# Altium project projet3.PrjPcb
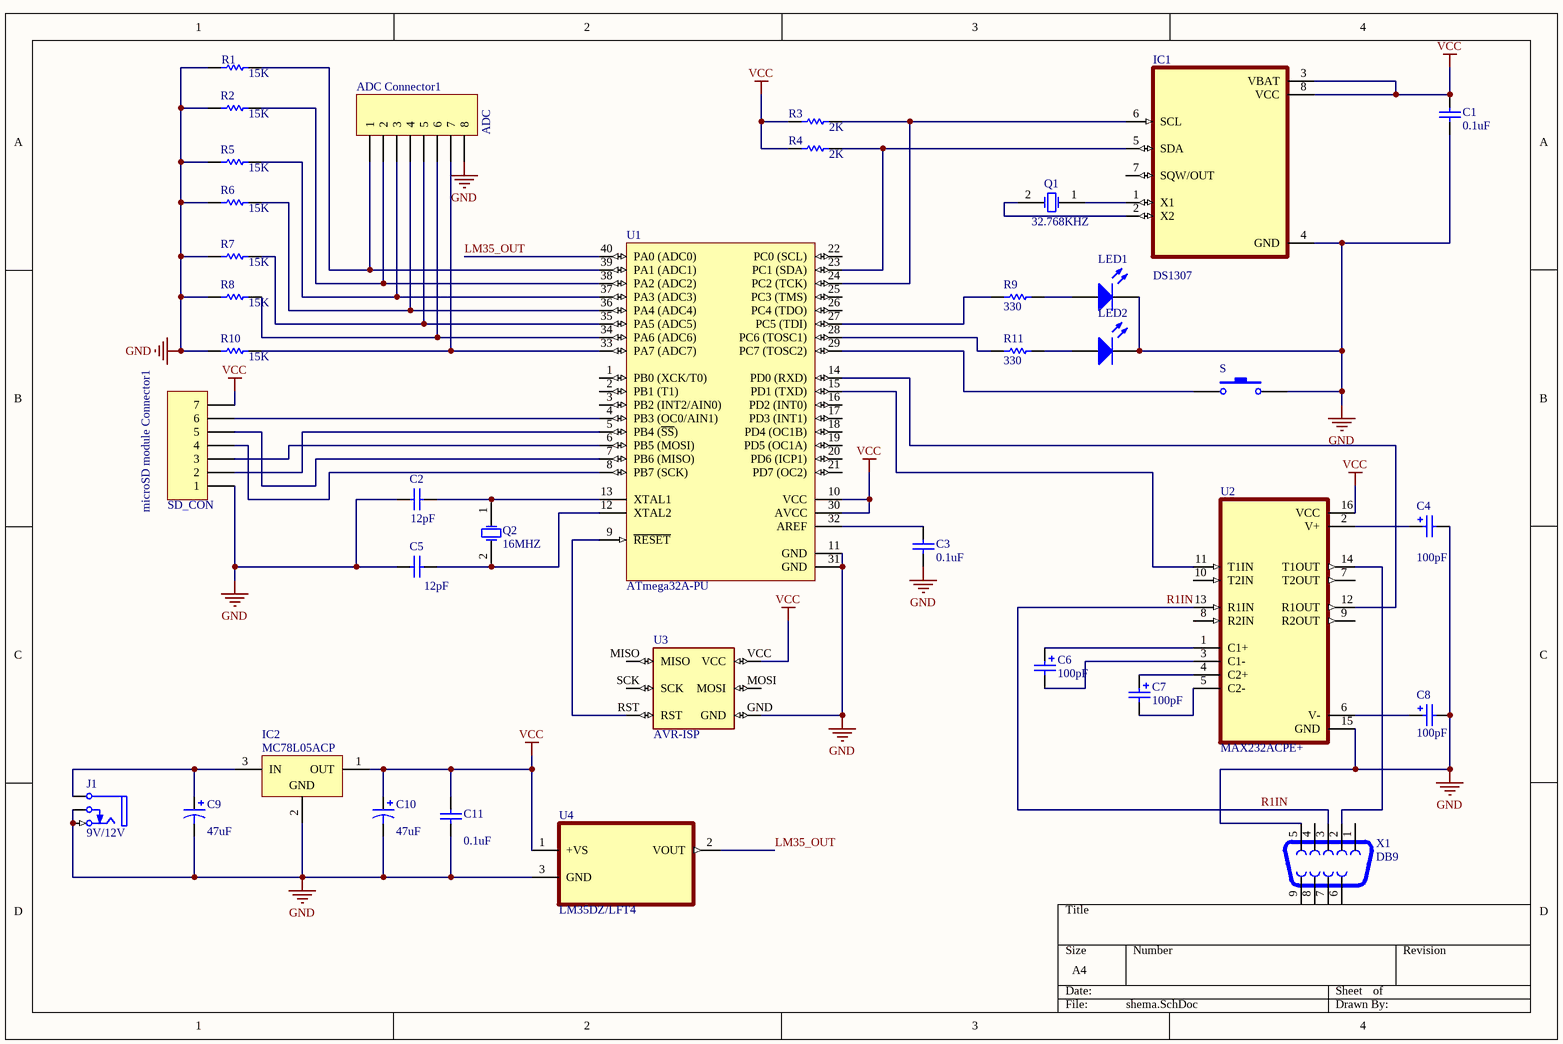
[diagram p0: shema.SchDoc]
1 sheet, 37 parts. Net scope: global (net labels, ports and power ports of the same name join across sheets).

## Sheet shema.SchDoc
size A4

### Parts
ADC_Connector1  ADC  [HDR1X8]
C1  value 0.1uF  [RAD-0.3]  (hidden comment: Cap)
C2  value 12pF  [RAD-0.3]  (hidden comment: Cap)
C3  value 0.1uF  [RAD-0.3]  (hidden comment: Cap)
C4  value 100pF  [POLAR0.8]  (hidden comment: Cap Pol2)
C5  value 12pF  [RAD-0.3]  (hidden comment: Cap)
C6  value 100pF  [POLAR0.8]  (hidden comment: Cap Pol2)
C7  value 100pF  [POLAR0.8]  (hidden comment: Cap Pol2)
C8  value 100pF  [POLAR0.8]  (hidden comment: Cap Pol2)
C9  value 47uF  [RB7.6-15]  (hidden comment: Cap Pol1)
C10  value 47uF  [RB7.6-15]  (hidden comment: Cap Pol1)
C11  value 0.1uF  [RAD-0.3]  (hidden comment: Cap)
IC1  DS1307  [DIP794W47P254L991H457Q8]
IC2  MC78L05ACP  [29-04]
J1  9V/12V  [JACK/6-V3A]
LED1  LED0  [LED-0]  (value not drawn)
LED2  LED0  [LED-0]  (value not drawn)
microSD_module_Connector1  SD_CON  [HDR1X7]
Q1  FREQ: 32.768KHZ  [R38]  (hidden comment: XTAL)
Q2  FREQ: 16MHZ  [R38]  (hidden comment: XTAL)
R1  value 15K  [AXIAL-0.3]  (hidden comment: Res1)
R2  value 15K  [AXIAL-0.3]  (hidden comment: Res1)
R3  value 2K  [AXIAL-0.3]  (hidden comment: Res1)
R4  value 2K  [AXIAL-0.3]  (hidden comment: Res1)
R5  value 15K  [AXIAL-0.3]  (hidden comment: Res1)
R6  value 15K  [AXIAL-0.3]  (hidden comment: Res1)
R7  value 15K  [AXIAL-0.3]  (hidden comment: Res1)
R8  value 15K  [AXIAL-0.3]  (hidden comment: Res1)
R9  value 330  [AXIAL-0.3]  (hidden comment: Res1)
R10  value 15K  [AXIAL-0.3]  (hidden comment: Res1)
R11  value 330  [AXIAL-0.3]  (hidden comment: Res1)
S  SW-PB  [SPST-2]  (value not drawn)
U1  ATmega32A-PU  [40P6]
U2  MAX232ACPE+  [DIP794W47P254L1943H457Q16]
U3  AVR-ISP  [AVR-ISP]
U4  LM35DZ/LFT4  [TO127P254X495-3P]
X1  DB9  [DB9]

### Nets
GND: ADC_Connector1.8 C1.1 C2.1 C3.2 C4.2 C5.1 C8.2 C9.2 C10.2 C11.1 IC1.4(GND) IC2.2(GND) J1.1(T) J1.2(TN) LED1.2(K) LED2.2(K) microSD_module_Connector1.1 R1.1 R2.1 R5.1 R6.1 R7.1 R8.1 R10.1 S.2 U1.11(GND) U1.31(GND) U2.15(GND) U3.GND U4.3(GND) X1.5
VCC: C1.2 C10.1 C11.2 IC1.3(VBAT) IC1.8(VCC) IC2.1(OUT) microSD_module_Connector1.7 R3.1 R4.1 U1.10(VCC) U1.30(AVCC) U2.16(VCC) U3.VCC U4.1(+VS)
LM35_OUT: U1.40(PA0_(ADC0)) U4.2(VOUT)
R1IN: U2.13(R1IN) X1.3
NetADC_Connector1_1: ADC_Connector1.1 R1.2 U1.39(PA1_(ADC1))
NetADC_Connector1_2: ADC_Connector1.2 R2.2 U1.38(PA2_(ADC2))
NetADC_Connector1_3: ADC_Connector1.3 R5.2 U1.37(PA3_(ADC3))
NetADC_Connector1_4: ADC_Connector1.4 R6.2 U1.36(PA4_(ADC4))
NetADC_Connector1_5: ADC_Connector1.5 R7.2 U1.35(PA5_(ADC5))
NetADC_Connector1_6: ADC_Connector1.6 R8.2 U1.34(PA6_(ADC6))
NetADC_Connector1_7: ADC_Connector1.7 R10.2 U1.33(PA7_(ADC7))
NetC2_2: C2.2 Q2.1(OSC1) U1.13(XTAL1)
NetC3_1: C3.1 U1.32(AREF)
NetC4_1: C4.1 U2.2(V+)
NetC5_2: C5.2 Q2.2(OSC2) U1.12(XTAL2)
NetC6_1: C6.1 U2.1(C1+)
NetC6_2: C6.2 U2.3(C1-)
NetC7_1: C7.1 U2.4(C2+)
NetC7_2: C7.2 U2.5(C2-)
NetC8_1: C8.1 U2.6(V-)
NetC9_1: C9.1 IC2.3(IN) J1.5(S)
NetIC1_1: IC1.1(X1) Q1.1(OSC1)
NetIC1_2: IC1.2(X2) Q1.2(OSC2)
NetIC1_5: IC1.5(SDA) R4.2 U1.23(PC1_(SDA))
NetIC1_6: IC1.6(SCL) R3.2 U1.24(PC2_(TCK))
NetLED1_1: LED1.1(A) R9.2
NetLED2_1: LED2.1(A) R11.2
NetmicroSD_module_Connector1_2: microSD_module_Connector1.2 U1.5(PB4_(~{SS}))
NetmicroSD_module_Connector1_3: microSD_module_Connector1.3 U1.6(PB5_(MOSI))
NetmicroSD_module_Connector1_4: microSD_module_Connector1.4 U1.8(PB7_(SCK))
NetmicroSD_module_Connector1_5: microSD_module_Connector1.5 U1.7(PB6_(MISO))
NetmicroSD_module_Connector1_6: microSD_module_Connector1.6 U1.4(PB3_(OC0/AIN1))
NetR9_1: R9.1 U1.27(PC5_(TDI))
NetR11_1: R11.1 U1.28(PC6_(TOSC1))
NetS_1: S.1 U1.29(PC7_(TOSC2))
NetU1_9: U1.9(~{RESET}) U3.RST
NetU1_14: U1.14(PD0_(RXD)) U2.12(R1OUT)
NetU1_15: U1.15(PD1_(TXD)) U2.11(T1IN)
NetU2_14: U2.14(T1OUT) X1.2

Not connected (* = marked no-connect by the designer): IC1 7(SQW/OUT); U1 1(PB0_(XCK/T0)) 2(PB1_(T1)) 3(PB2_(INT2/AIN0)) 16(PD2_(INT0)) 17(PD3_(INT1)) 18(PD4_(OC1B)) 19(PD5_(OC1A)) 20(PD6_(ICP1)) 21(PD7_(OC2)) 22(PC0_(SCL)) 25(PC3_(TMS)) 26(PC4_(TDO)); U2 7(T2OUT) 8(R2IN) 9(R2OUT) 10(T2IN); U3 MISO MOSI SCK; X1 1 4 6 7 8 9

### Library data of the parts
ADC_Connector1 = Header 8: Header, 8-Pin; LatestRevisionDate: 17-Jul-2002; LatestRevisionNote: Re-released for DXP Platform.; Publisher: Altium Limited
C1-C3 C5 C11 = Cap: Capacitor; Published: 8-Jun-2000; LatestRevisionDate: 17-Jul-2002; LatestRevisionNote: Re-released for DXP Platform.; PackageReference: RAD-0.3; Publisher: Altium Limited; PackageDescription: Radial Cap, Thru-Hole; 2 Leads; 0.3 in Pin Spacing
C4 C6-C8 = Cap Pol2: Polarized Capacitor (Axial); Published: 8-Jun-2000; LatestRevisionDate: 17-Jul-2002; LatestRevisionNote: Re-released for DXP Platform.; PackageReference: POLAR0.8; Publisher: Altium Limited; PackageDescription: Polarized Capacitor; 2 Leads
C9 C10 = Cap Pol1: Polarized Capacitor (Radial); Published: 8-Jun-2000; LatestRevisionDate: 17-Jul-2002; LatestRevisionNote: Re-released for DXP Platform.; PackageReference: RB7.6-15; Publisher: Altium Limited; PackageDescription: Polarized Capacitor (Radial); 2 Leads
IC1 = DS1307: Real Time Clock (RTC) IC Clock/Calendar 56B IÂ²C, 2-Wire Serial 8-SOIC (0.154, 3.90mm Width); MF: Maxim Integrated; MP: DS1307; Price: None; Purchase-URL: https://pricing.snapeda.com/search/part/DS1307/?ref=eda; Package: DIP-8 Maxim Integrated; Check_prices: https://www.snapeda.com/parts/DS1307/Maxim+Integrated/view-part/?ref=eda; Value: *; Availability: In Stock; SnapEDA_Link: https://www.snapeda.com/parts/DS1307/Maxim+Integrated/view-part/?ref=snap
IC2 = MC78L05ACP: 3-Terminal Low-Current Positive Fixed Voltage Regulator; Published: 17-Jul-2002; DatasheetVersion: 1988; PackageVersion: 1996; PackageReference: 29-04; Publisher: Altium Limited; PackageDescription: TO, Flat Index; 3 In-Line, Axial Leads; Body Dia. 4.8mm; Leads 0.48 x 0.5 mm (max); ComponentLink1Description: Manufacturer Link; ComponentLink1URL: http://www.onsemi.com/site/products/taxonomy/0,4438,503,00.html; ComponentLink2Description: Datasheet; ComponentLink2URL: http://www.onsemi.com/pub/Collateral/MC78L00A-D.PDF
J1 = Phonejack2 TN: Jack Socket, 1/4" [6.5mm], Thru-Hole, Vertical, 2-Conductor with Tip closed; PackageDocument: 2003; PCB_Layout: Complies with manufacturer's recommendation.; DrillAndSlotSize: Corresponds to nominal value.; LatestRevisionDate: 15-Jul-2004; LatestRevisionNote: Component Replaced & renamed from "Phonejack".; DatasheetDocument: 2003; PackageReference: S1VS_SNB; Publisher: Altium Limited; ComponentLink1Description: Manufacturer Link; ComponentLink1URL: http://www.cliffuk.co.uk/
LED1 LED2 = LED0: Typical INFRARED GaAs LED; Published: 8-Jun-2000; LatestRevisionDate: 08-Jul-2005; LatestRevisionNote: Mech Layer 1 removed.; PackageReference: LED-0; Publisher: Altium Limited; PackageDescription: LED; 2 Leads
microSD_module_Connector1 = Header 7: Header, 7-Pin; LatestRevisionDate: 17-Jul-2002; LatestRevisionNote: Re-released for DXP Platform.; Publisher: Altium Limited
Q1 Q2 = XTAL: Crystal Oscillator; Published: 8-Jun-2000; LatestRevisionDate: 17-Jul-2002; LatestRevisionNote: Re-released for DXP Platform.; PackageReference: R38; Publisher: Altium Limited; PackageDescription: Crystal, Thru-Hole; 2 Leads; Body 3.1 x 8.2 mm (Dia.xH)
R1-R11 = Res1: Resistor; Published: 8-Jun-2000; LatestRevisionDate: 17-Jul-2002; LatestRevisionNote: Re-released for DXP Platform.; PackageReference: AXIAL-0.3; Publisher: Altium Limited; PackageDescription: Axial Device, Thru-Hole; 2 Leads; 0.3 in Pin Spacing
S = SW-PB: Switch; Published: 24-Mar-1999; LatestRevisionDate: 17-Jul-2002; LatestRevisionNote: Re-released for DXP Platform.; PackageReference: SPST-2; Publisher: Altium Limited; PackageDescription: Switch; 2 Leads
U1 = ATmega32A-PU: 8-bit AVR Microcontroller, 32KB Flash, 1KB EEPROM, 2KB SRAM, 40-pin PDIP, Industrial Grade (-40°C to 85°C); Published: 1-Apr-2010; DatasheetVersion: revB, Jul-2009; PackageVersion: revB, Sep-2001; PackageReference: 40P6; Publisher: Altium Limited; PackageDescription: 40-lead (0.600"/15.24mm Wide) Plastic Dual Inline Package (PDIP); Supplier 1: Digi-Key; Supplier Part Number 1: ATMEGA32A-PU-ND; Supplier 2: Farnell; Supplier Part Number 2: 1704565; Supplier 3: Mouser; Supplier Part Number 3: 556-ATMEGA32A-PU; Code_JEDEC: MS-011-AC; ComponentLink1Description: Manufacturer Link; ComponentLink1URL: http://www.atmel.com/products/avr/default.asp?; ComponentLink2Description: ATmega32A Datasheet; ComponentLink2URL: http://www.atmel.com/dyn/resources/prod_documents/doc8155.pdf; ComponentLink3Description: ATmega32A Summary; ComponentLink3URL: http://www.atmel.com/dyn/resources/prod_documents/8155S.pdf; ComponentLink4Description: Atmel.com Home; ComponentLink4URL: http://www.atmel.com
U2 = MAX232ACPE+: 2/2 Transceiver Full RS232 16-PDIP; MF: Maxim Integrated; Package: DIP-16 Maxim Integrated; MP: MAX232ACPE; Value: *; SnapEDA_Link: https://www.snapeda.com/parts/MAX232ACPE/Maxim%20Integrated/view-part/294215/?ref=snap; Availability: Unavailable; Price: None
U3 = AVR-ISP: Emulators / Simulators AVR USB IN CIRCUIT EMUL/PRGMR ISP; MF: Gravitech; SnapEDA_Link: https://www.snapeda.com/parts/AVR-ISP/Gravitech/view-part/4593377/?ref=snap; MP: AVR-ISP; Availability: Unavailable; Price: None; Value: *; Package: None
U4 = LM35DZ/LFT4: &plusmn;0.5&deg;C 4V-30V, Temperature sensor with analog output 3-TO-92; MF: Texas Instruments; Texas_Instruments-Purchase-URL: https://snapeda.com/shop?store=Texas+Instruments&id=19434; Availability: Warning; Mouser-Purchase-URL: https://snapeda.com/shop?store=Mouser&id=19434; Price: None; DigiKey-Purchase-URL: https://snapeda.com/shop?store=DigiKey&id=19434; Package: TO-92-3 Texas Instruments; Value: *; SnapEDA_Link: https://www.snapeda.com/parts/LM35DZ/LFT4/Texas%20Instruments/view-part/19434/?ref=snap; MP: LM35DZ/LFT4; BuyPart: https://www.snapeda.com/parts/LM35DZ/LFT4/Texas%20Instruments/view-part/19434/?ref=eda
X1 = DB9: SURGE SUPPRESSOR RS-232 DB9M/F; MF: Tripp Lite; Package: None; Price: None; SnapEDA_Link: https://www.snapeda.com/parts/DB9/Tripp%20Lite/view-part/4219179/?ref=snap; Availability: Unavailable; Value: *; MP: DB9